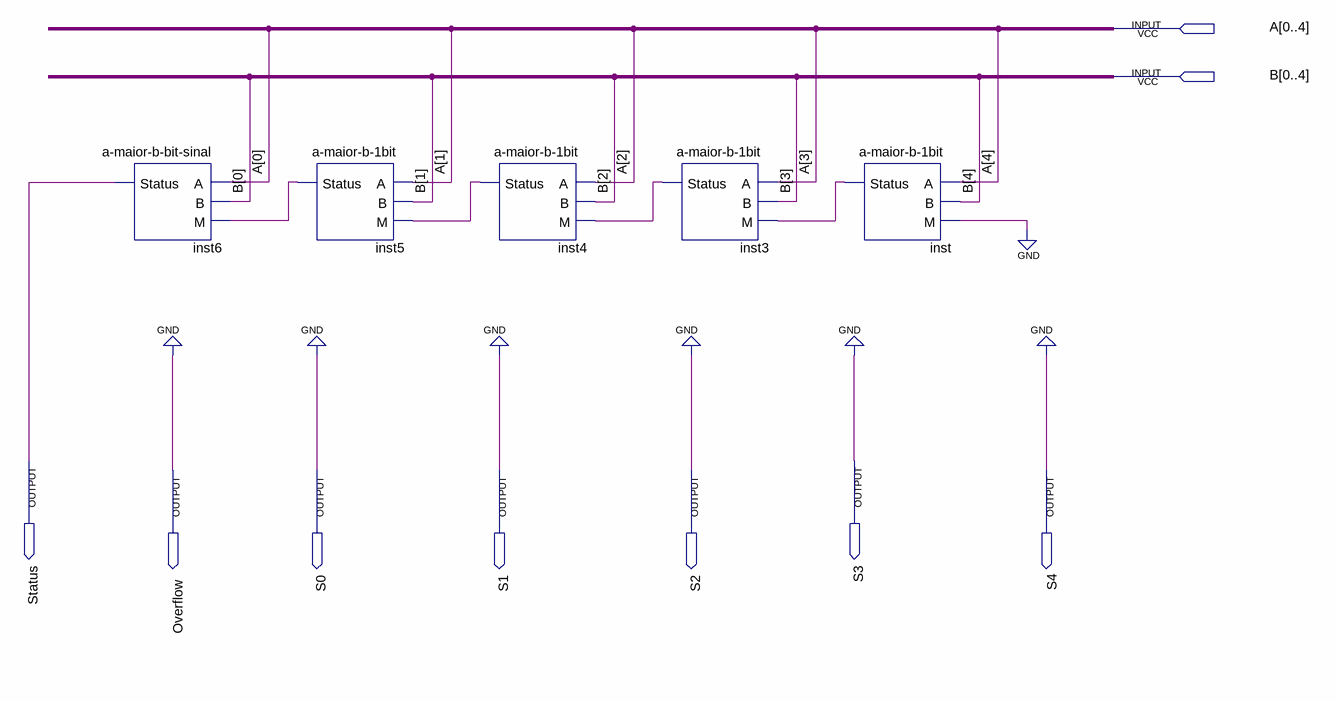
[diagram p0: schematic sheet]
// Quartus schematic a-maior-b-5bit.bdf as structural Verilog: 5 symbols, 9 pins
module \a-maior-b-5bit  (
  input  [0:4] A,
  input  [0:4] B,
  output Status,
  output S3,
  output Overflow,
  output S0,
  output S1,
  output S2,
  output S4
);

  wire inst3_status, inst4_status, inst5_status, inst_status;

  \a-maior-b-bit-sinal  inst6 (.A(A[0]), .B(B[0]), .M(inst5_status), .Status(Status));
  \a-maior-b-1bit  inst5 (.A(A[1]), .B(B[1]), .M(inst4_status), .Status(inst5_status));
  \a-maior-b-1bit  inst4 (.A(A[2]), .B(B[2]), .M(inst3_status), .Status(inst4_status));
  \a-maior-b-1bit  inst3 (.A(A[3]), .B(B[3]), .M(inst_status), .Status(inst3_status));
  \a-maior-b-1bit  inst (.A(A[4]), .B(B[4]), .M(1'b0), .Status(inst_status));

  assign Overflow = 1'b0;
  assign S0 = 1'b0;
  assign S1 = 1'b0;
  assign S2 = 1'b0;
  assign S3 = 1'b0;
  assign S4 = 1'b0;
endmodule
